# EAGLE design STM8S003 -OSH (EAGLE 6.5.0)
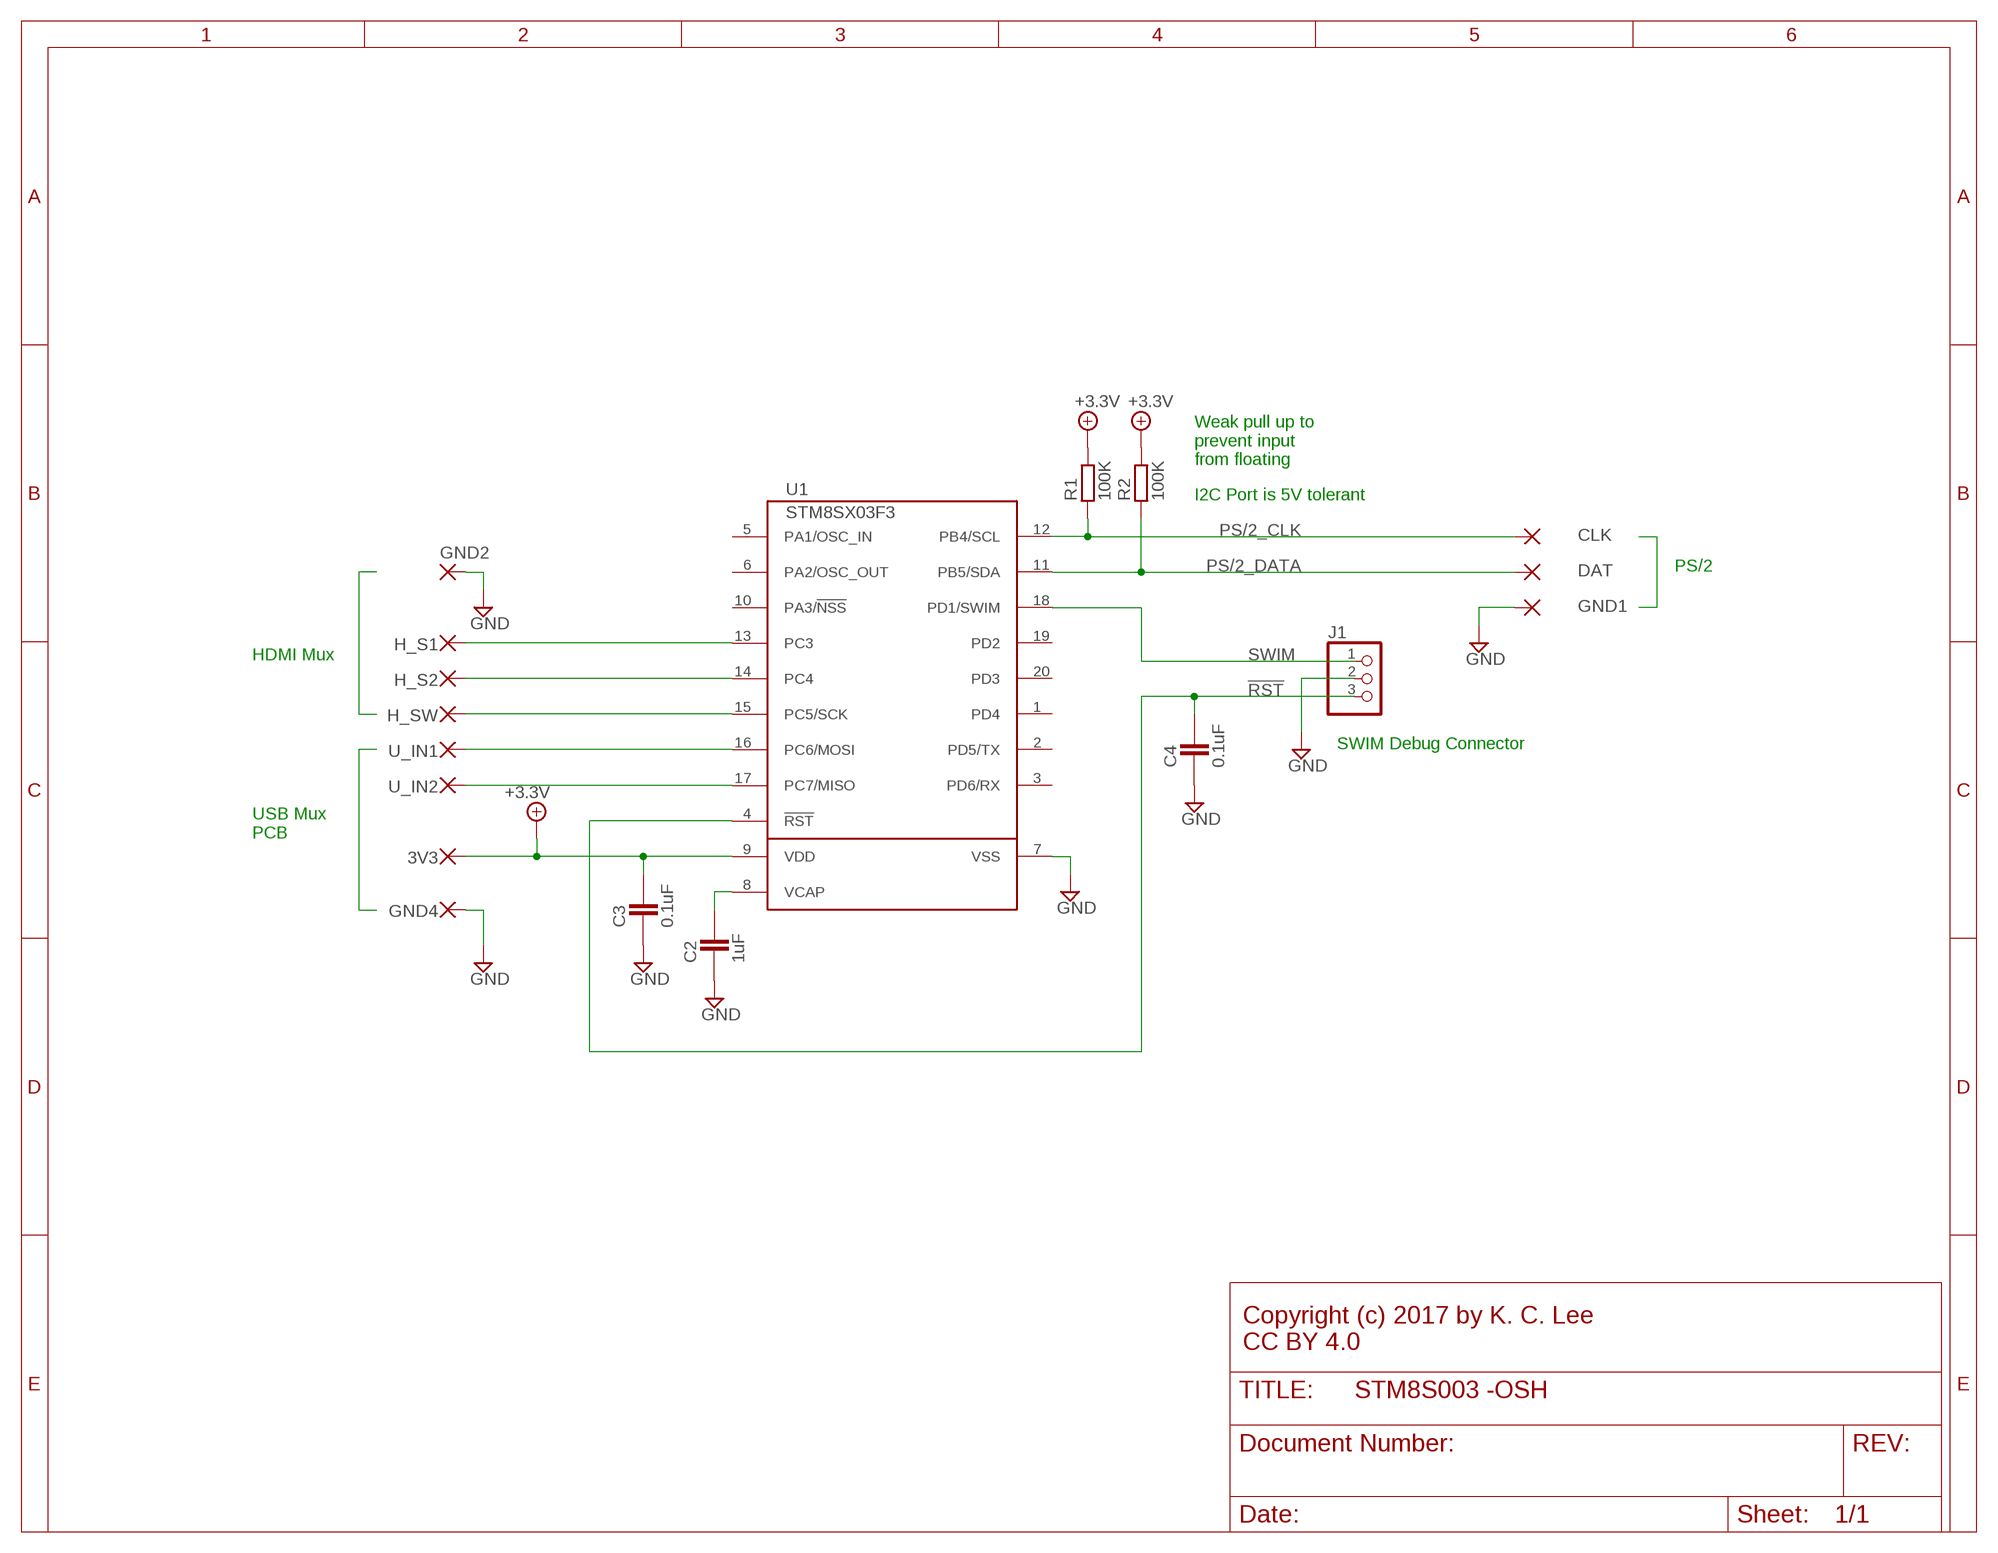
[diagram p0: schematic, sheet 1]

## Parts
3V3  SMD2  [SMD1,27-2,54]
C2  1uF  CAPACITOR_0603  [CAPC1608X92N]
C3  0.1uF  CAPACITOR_0603  [CAPC1608X92N]
C4  0.1uF  CAPACITOR_0603  [CAPC1608X92N]
CLK  SMD2  [SMD1,27-2,54]
DAT  SMD2  [SMD1,27-2,54]
GND1  SMD2  [SMD1,27-2,54]
GND2  SMD2  [SMD1,27-2,54]
GND4  SMD2  [SMD1,27-2,54]
H_S1  SMD2  [SMD1,27-2,54]
H_S2  SMD2  [SMD1,27-2,54]
H_SW  SMD2  [SMD1,27-2,54]
J1  PINHD-1X3  [1X03]
R1  100K  RESISTOR_0603  [RESC1608X55N]
R2  100K  RESISTOR_0603  [RESC1608X55N]
U1  STM8SX03F3  [TSSOP20]
U_IN1  SMD2  [SMD1,27-2,54]
U_IN2  SMD2  [SMD1,27-2,54]

## Nets
!RST: C4.2 J1.3 U1.4(!RST)
+3.3V: 3V3.1(P) C3.2 R1.2 R2.2 U1.9(VDD)
GND: C2.1 C3.1 C4.1 GND1.1(P) GND2.1(P) GND4.1(P) J1.2 U1.7(VSS)
N$1: C2.2 U1.8(VCAP)
N$4: U1.17(PC7/MISO) U_IN2.1(P)
N$5: U1.16(PC6/MOSI) U_IN1.1(P)
N$6: H_SW.1(P) U1.15(PC5/SCK)
N$7: H_S1.1(P) U1.13(PC3)
N$8: H_S2.1(P) U1.14(PC4)
PS/2_CLK: CLK.1(P) R1.1 U1.12(PB4/SCL)
PS/2_DATA: DAT.1(P) R2.1 U1.11(PB5/SDA)
SWIM: J1.1 U1.18(PD1/SWIM)
Unconnected: U1.1(PD4) U1.2(PD5/TX) U1.3(PD6/RX) U1.5(PA1/OSC_IN) U1.6(PA2/OSC_OUT) U1.10(PA3/!NSS) U1.19(PD2) U1.20(PD3)

## Notes on the sheet
- Weak pull up to
  prevent input 
  from floating
- I2C Port is 5V tolerant
- PS/2
- HDMI Mux
- SWIM Debug Connector
- USB Mux
  PCB
- Copyright (c) 2017 by K. C. Lee
  CC BY 4.0

## Library data of the parts
3V3 CLK DAT GND1 GND2 GND4 H_S1 H_S2 H_SW U_IN1 U_IN2 = wirepad:SMD2: SMD PAD
C2-C4 = ipc-7351-capacitor:CAPACITOR_
J1 = Misc Conn:PINHD-1X3: PIN HEADER
R1 R2 = ipc-7351-resistor:RESISTOR_
U1 = Misc Processor:STM8SX03F

## Board
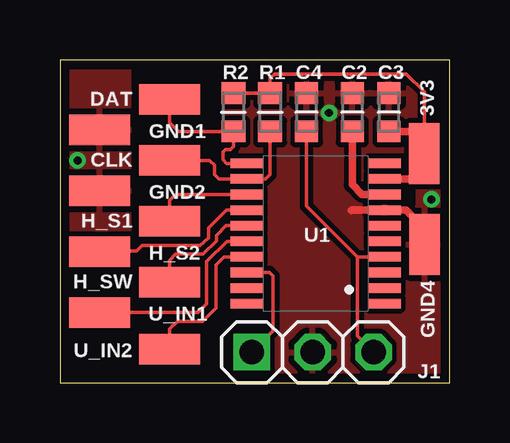
[diagram p1: board, top side]
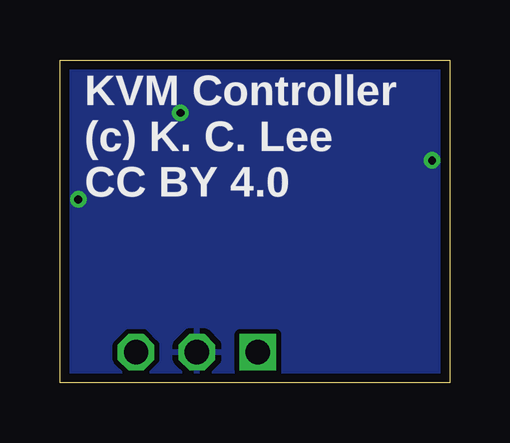
[diagram p2: board, bottom side, seen from below]

Size 16.26 x 13.46 mm. Coordinates in mm from the lower left corner, seen from the top.
Outline: 0,0 16.26,0 16.26,13.46 0,13.46 0,0
Copper layers (1*16): Top 0.0356mm / dielectric 1.5011mm / Bottom 0.0356mm
Design rules "oshpark-2layer": minimum track width 6mil, minimum drill 13mil, track to track 6mil, track to pad 6mil, pad to pad 6mil, via to via 6mil, smd to smd 6mil, copper to edge 15mil, drill to drill 6mil, minimum pad ring 7mil, minimum via ring 7mil, stop-mask expansion 4mil, vias tented up to drill 0mil, thermal gap 10mil
tRestrict: 6 lines

### Footprints (pad centres in the part's own frame; a part is rotated, then mirrored left to right if it is on the bottom)
SMD1,27-2,54 = smd 1.27 x 2.54: 1 0,0
CAPC1608X92N = smd 0.9 x 0.95: 1 -0.8,0; 2 0.8,0
1X03 = drill 1.016 square: 1 -2.54,0 | drill 1.016 octagon: 2 0,0; 3 2.54,0
RESC1608X55N = smd 0.9 x 1: 1 -0.8,0; 2 0.8,0
TSSOP20 = smd 0.4 x 1.35: 1 -2.925,-2.875; 2 -2.275,-2.875; 3 -1.625,-2.875; 4 -0.975,-2.875; 5 -0.325,-2.875; 6 0.325,-2.875; 7 0.975,-2.875; 8 1.625,-2.875; 9 2.275,-2.875; 10 2.925,-2.875; 11 2.925,2.875; 12 2.275,2.875; 13 1.625,2.875; 14 0.975,2.875; 15 0.325,2.875; 16 -0.325,2.875; 17 -0.975,2.875; 18 -1.625,2.875; 19 -2.275,2.875; 20 -2.925,2.875

### Placement (x,y rotation side)
3V3  15.19,9.55 180 top
C2  12.19,11.28 270 top
C3  13.72,11.28 270 top
C4  10.29,11.28 270 top
CLK  4.57,9.27 90 top
DAT  4.57,11.81 90 top
GND1  1.65,10.54 90 top
GND2  1.65,8 90 top
GND4  15.21,5.77 0 top
H_S1  4.57,6.73 90 top
H_S2  1.65,5.46 90 top
H_SW  4.57,4.19 90 top
J1  10.54,1.27 0 top
R1  8.76,11.28 90 top
R2  7.24,11.28 90 top
U1  10.67,6.22 90 top
U_IN1  1.65,2.92 90 top
U_IN2  4.57,1.4 90 top

### Tracks (layer width: path | path; a pad name or v marks a point on that pad's centre or on a via)
!RST
  Top 0.152: U1.4 12.4,5.25 | 12.4,5.25 10.29,7.37 C4.2 | 12.4,5.25 12.4,1.95 J1.3
+3.3V
  Top 0.152: R2.2 R1.2 8.76,12.7 8.94,12.88 14.45,12.88 15.19,12.14 15.19,10.41 3V3.1
  Top 0.254: 14.85,8.5 15.11,8.76 15.11,9.47 3V3.1 | 15.13,10.48 15.19,10.41
  Top 0.305: U1.9 14.85,8.5 | C3.2 15.13,10.48
GND  (via drill 0.33)
  Top 0.305: 12.17,7.19 12.18,7.2 U1.7 14.42,7.2 15.11,6.5
  other vias: 0.74,9.27 15.49,7.65 11.23,11.25
  pour Top (isolate 0.203): 0.03,0.03 0,13.46 16.26,13.46 16.28,0.03
  pour Bottom (isolate 0.203): 16.28,0.03 16.26,13.46 0,13.46 0.03,0.03
N$1
  Top 0.305: C2.2 12.19,8.26 12.6,7.85 U1.8
N$4
  Top 0.152: U1.17 6.85,5.25 6.5,4.9 6.5,3.12 5.94,2.56 4.9,2.56 4.57,2.23 U_IN2.1
N$5
  Top 0.152: U_IN1.1 5.77,2.92 6.12,3.28 6.12,5.05 6.96,5.9 U1.16
N$6
  Top 0.152: U1.15 6.93,6.55 6.53,6.15 6.53,5.92 5.97,5.36 4.83,5.36 4.57,5.11 H_SW.1
N$7
  Top 0.152: U1.13 4.83,7.85 4.57,7.59 H_S1.1
N$8
  Top 0.152: H_S2.1 1.68,5.49 3.2,5.49 3.43,5.71 5.84,5.71 6.2,6.04 6.2,6.45 6.94,7.2 U1.14
PS/2_CLK
  Top 0.152: R1.1 8.76,8.69 8.57,8.5 U1.12 6.64,8.5 6.45,8.69 6.45,9.07 6.25,9.27 CLK.1
PS/2_DATA
  Top 0.152: DAT.1 4.57,10.85 4.94,10.48 R2.1 7.24,9.86 7.11,9.73 6.91,9.73 6.81,9.63 6.81,9.3 6.96,9.15 U1.11
SWIM
  Top 0.152: U1.18 8.74,4.6 8.89,4.45 8.89,2.16 J1.1

### Text on the board
bNames: KVM Controller / (c) K. C. Lee / CC BY 4.0